# EAGLE schematic untitled (EAGLE 8.2.2)
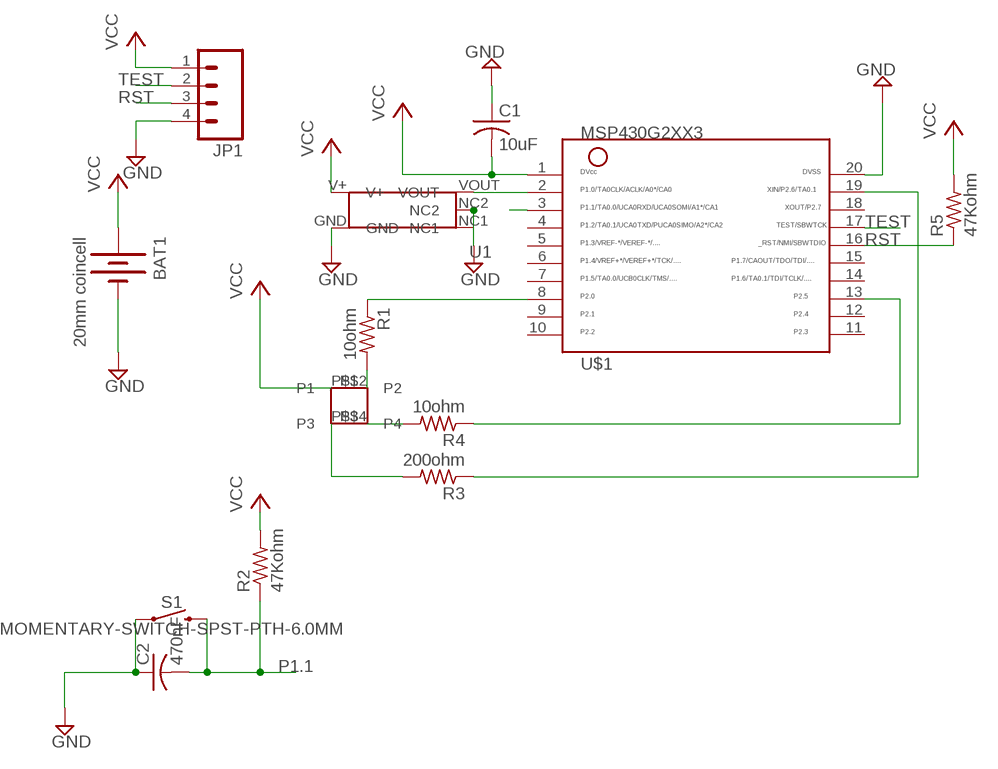
[diagram p0: schematic, sheet 1]

## Parts
BAT1  20mm coincell  BATTERYFOB  [BATTCON_20MM_PTH_COMPACT]
C1  10uF  C-USC1206  [C1206]
C2  470nF  C-USC1206  [C1206]
JP1  M04LOCK  [1X04_LOCK]
R1  10ohm  R-US_R1206  [R1206]
R2  47Kohm  R-US_R1206  [R1206]
R3  200ohm  R-US_R1206  [R1206]
R4  10ohm  R-US_R1206  [R1206]
R5  47Kohm  R-US_R1206  [R1206]
S1  MOMENTARY-SWITCH-SPST-PTH-6.0MM  [TACTILE_SWITCH_PTH_6.0MM]
U1  TEMPERATURE_SENSOR  [SOT_563]
U$1  MSP430G2XX3TSSOP  [PW20]
U$2  RGB_LED  [1210RGB]

## Nets
GND: BAT1.2(-) C1.1 C2.1 JP1.4 S1.1 U1.GND U1.NC1 U1.NC2 U$1.20
N$1: U1.VOUT U$1.2
N$2: R4.2 U$2.P$4(P4)
N$3: R1.2 U$2.P$2(P2)
N$4: R3.2 U$2.P$3(P3)
N$5: R4.1 U$1.13
N$6: R3.1 U$1.19
N$7: R1.1 U$1.8
P1.1: C2.2 R2.1 S1.3 U$1.3
RST: JP1.3 R5.1 U$1.16
TEST: JP1.2 U$1.17
VCC: BAT1.1(+) BAT1.3(+) BAT1.4(+) BAT1.5(+) C1.2 JP1.1 R2.2 R5.2 U1.V+ U$1.1 U$2.P$1(P1)
Unconnected: U$1.4 U$1.5 U$1.6 U$1.7 U$1.9 U$1.10 U$1.11 U$1.12 U$1.14 U$1.15 U$1.18

## Library data of the parts
BAT1 = Battery:BATTERY: Compact CR2032 Battery Holder SMT ground pad 20MM_4LEGS, Digikey: BAT-HLD-001-THM-OTL
C1 = resistor:C-US: CAPACITOR, American symbol
C2 = rcl:C-US: CAPACITOR, American symbol
JP1 = Pendant:M04: Header 4 Standard 4-pin 0.1" header. Use with straight break away headers (SKU : PRT-00116), right angle break away headers (PRT-00553), swiss pins (PRT-00743), machine pins (PRT-00117), and female headers (PRT-00115). Molex polarized connector foot print use with SKU : PRT-08231 with associated crimp pins and housings.
R1-R5 = resistor:R-US_: RESISTOR, American symbol
S1 = SparkFun-Switches:MOMENTARY-SWITCH-SPST: Momentary Switch (Pushbutton) - SPST Normally-open (NO) SPST momentary switches (buttons, pushbuttons). Variants PTH-12MM - 12mm square, through-hole Momentary Pushbutton Switch - 12mm Square <https://www.sparkfun.com/products/9190> (COM-09190) PTH-6.0MM, PTH-6.0MM-KIT - 6.0mm square, through-hole Mini Pushbutton Switch <https://www.sparkfun.com/products/97> (COM-00097) KIT package intended for soldering kit's - only one side of pads' copper is exposed. PTH-RIGHT-ANGLE-KIT - Right-angle, through-hole Right Angle Tactile Button <https://www.sparkfun.com/products/10791> - Used on SparkFun BigTime Watch Kit <https://www.sparkfun.com/products/11734> SMD-12MM - 12mm square, surface-mount Tactile Button - SMD (12mm) <https://www.sparkfun.com/products/12993> (COM-12993) Used on SparkFun PicoBoard <https://www.sparkfun.com/products/11888> SMD-4.5MM - 4.5mm Square Trackball Switch Used on SparkFun Blackberry Trackballer Breakout <https://www.sparkfun.com/products/13169> SMD-4.6MMX2.8MM - 4.60mm x 2.80mm, surface mount Used on SparkFun SAMD21 Mini Breakout <https://www.sparkfun.com/products/13664> SMD-5.2MM, SMD-5.2-REDUNDANT - 5.2mm square, surface-mount Mini Pushbutton Switch - SMD <https://www.sparkfun.com/products/8720> (COM-08720) Used on Arduino Pro Mini <https://www.sparkfun.com/products/11114> REDUNDANT package connects both switch circuits together SMD-6.0X3.5MM - 6.0 x 3.5mm, surface mount Momentary Reset Switch SMD <https://www.sparkfun.com/products/8229> (COM-08229) SMD-6.2MM-TALL - 6.2mm square, surface mount Tactile Button - SMD (6mm) <https://www.sparkfun.com/products/12992> Used on SparkFun Digital Sandbox <https://www.sparkfun.com/products/12651> SMD-RIGHT-ANGLE - Right-angle, surface mount Used on SparkFun Block for Intel® Edison - Arduino <https://www.sparkfun.com/products/13036>; PROD_ID: SWCH-08441; SF_SKU: COM-00097
U1 = ELEC327:TEMPERATURE_SENSOR
U$1 = ELEC327:MSP430G2XX3: MSP430G2XX3 PDIP (N) 20 Pin Package
U$2 = ELEC327:RGB_LED